# EasyEDA schematic LM471.json
TITLE: Sheet_1; REV: 1.0; Date: 2024-01-02; Sheet: 1/1; Company: Your Company
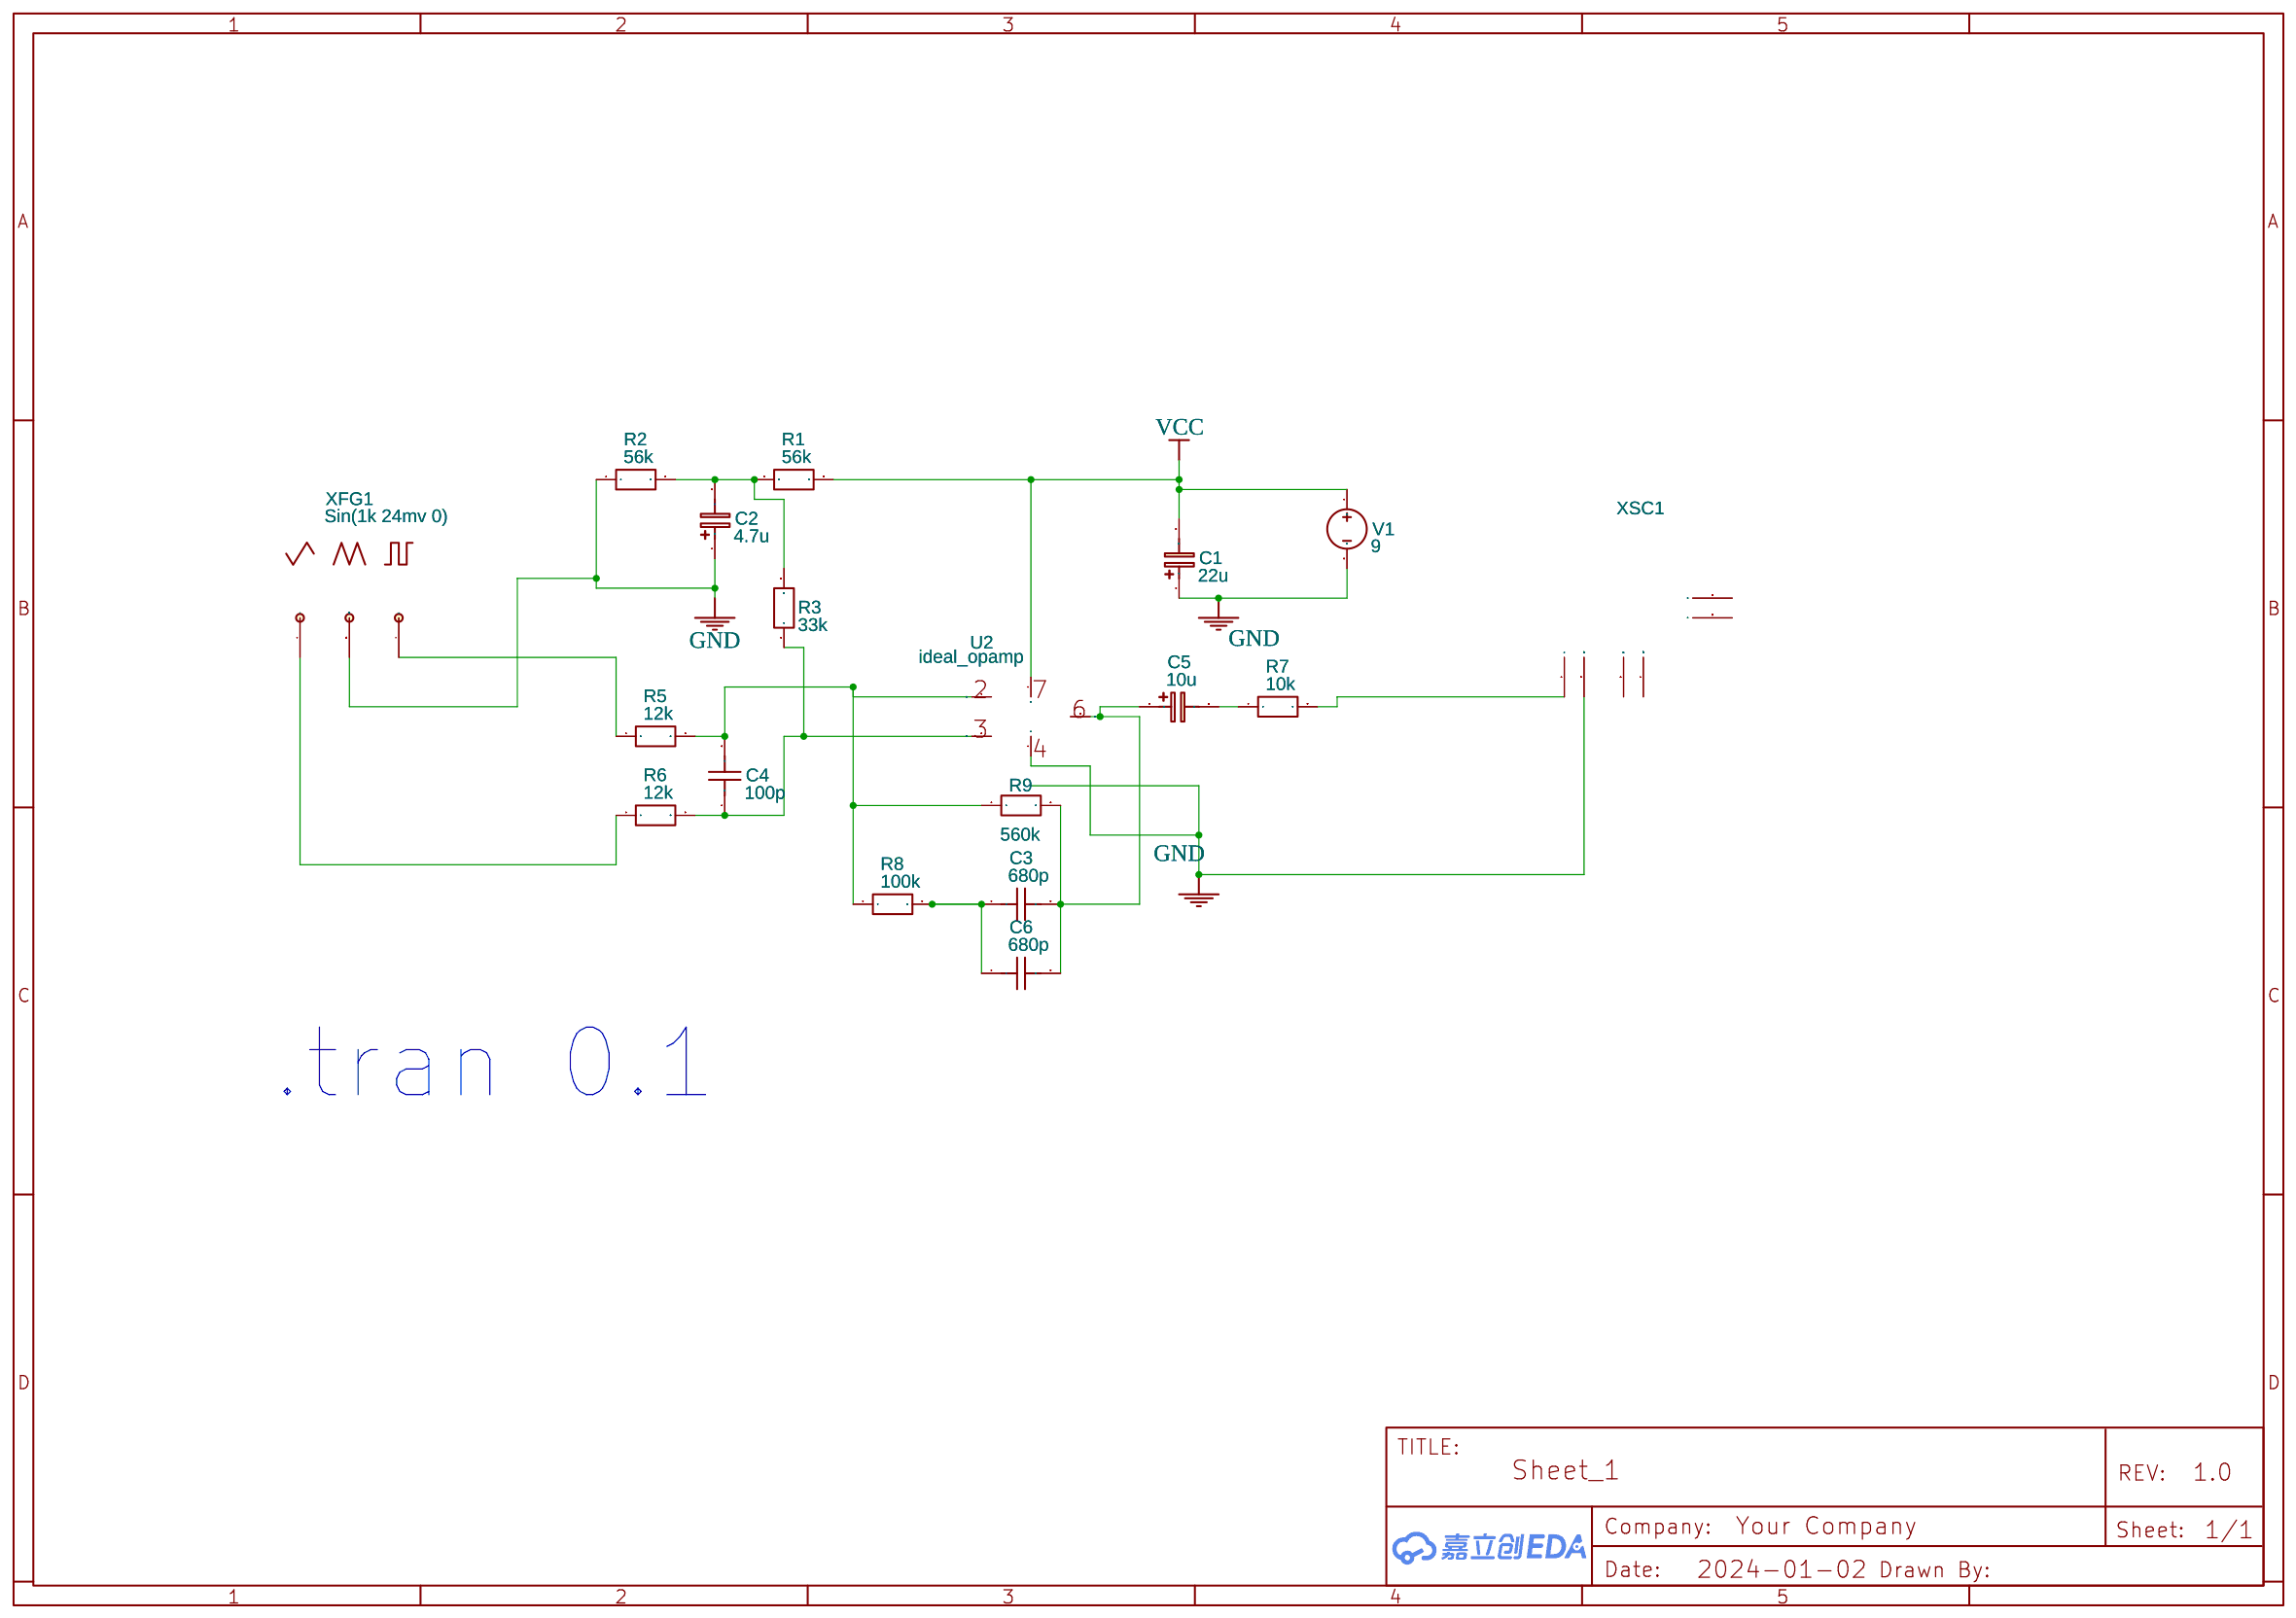
[diagram p0: schematic sheet]

## Parts
C1  22u  [SMD]
C2  4.7u  [SMD]
C3  680p  [C0603]
C4  100p  [C0603]
C5  10u  [SMD]
C6  680p  [C0603]
R1  56k  [R0603]
R2  56k  [R0603]
R3  33k  [R0603]
R5  12k  [R0603]
R6  12k  [R0603]
R7  10k  [R0603]
R8  100k  [R0603]
R9  560k  [R0603]
U2  ideal_opamp  [LM741CN-DIP-8]
V1  9  [HDR1X2]
XFG1  Sin(1k 24mv 0)
XSC1  Oscilloscope

## Library data of the parts
C1 C2 C5 = C_Tan_SMD_A_EU: Contributor: LCEDA_Lib
C3 C4 C6 = C_0603_US: Contributor: LCEDA_Lib
R1-R3 R5-R9 = R_0603_EU: Contributor: LCEDA_Lib
U2 = LM741: Contributor: juan_g2; sim: true
V1 = VDC: Contributor: EasyEDA; sim: true
XFG1 = FUNCTIONGENERATOR: Supplier: LCSC; Waveforms: Sine Wave; Frequency: 1k; Duty cycle: 50; Amplitude: 24mv; Offset: 0; Rise/Fall Time: 10; NameDisplay: 1; Contributor: EasyEDA; sim: true
XSC1 = OSCILLOSCOPE: Contributor: EasyEDA; NameDisplay: 0; sim: true

## Nets
GND: C1.1 C2.1 R2.1 U2.4(V-) V1.2 XFG1.COM XSC1.2(GND1)
VCC: C1.2 R1.2 U2.7(V+) V1.1
Net-(C2-2): C2.2 R1.1 R2.2 R3.2
Net-(C3-1): C3.1 C6.1 R8.2
Net-(C3-2): C3.2 C5.1 C6.2 R9.2 U2.6(OUT)
Net-(C4-1): C4.1 R3.1 R6.2 U2.3(IN+)
Net-(C4-2): C4.2 R5.2 R8.1 R9.1 U2.2(IN-)
Net-(C5-2): C5.2 R7.1
Net-(R5-1): R5.1 XFG1.-
Net-(R6-1): R6.1 XFG1.+
Net-(R7-2): R7.2 XSC1.1(A)

Not connected (* = marked no-connect by the designer): XSC1 3(B) 4(GND2) 5(T+) 6(T-)

## Notes on the sheet
- .tran 0.1
